# EAGLE design pdu (EAGLE 9.6.2)
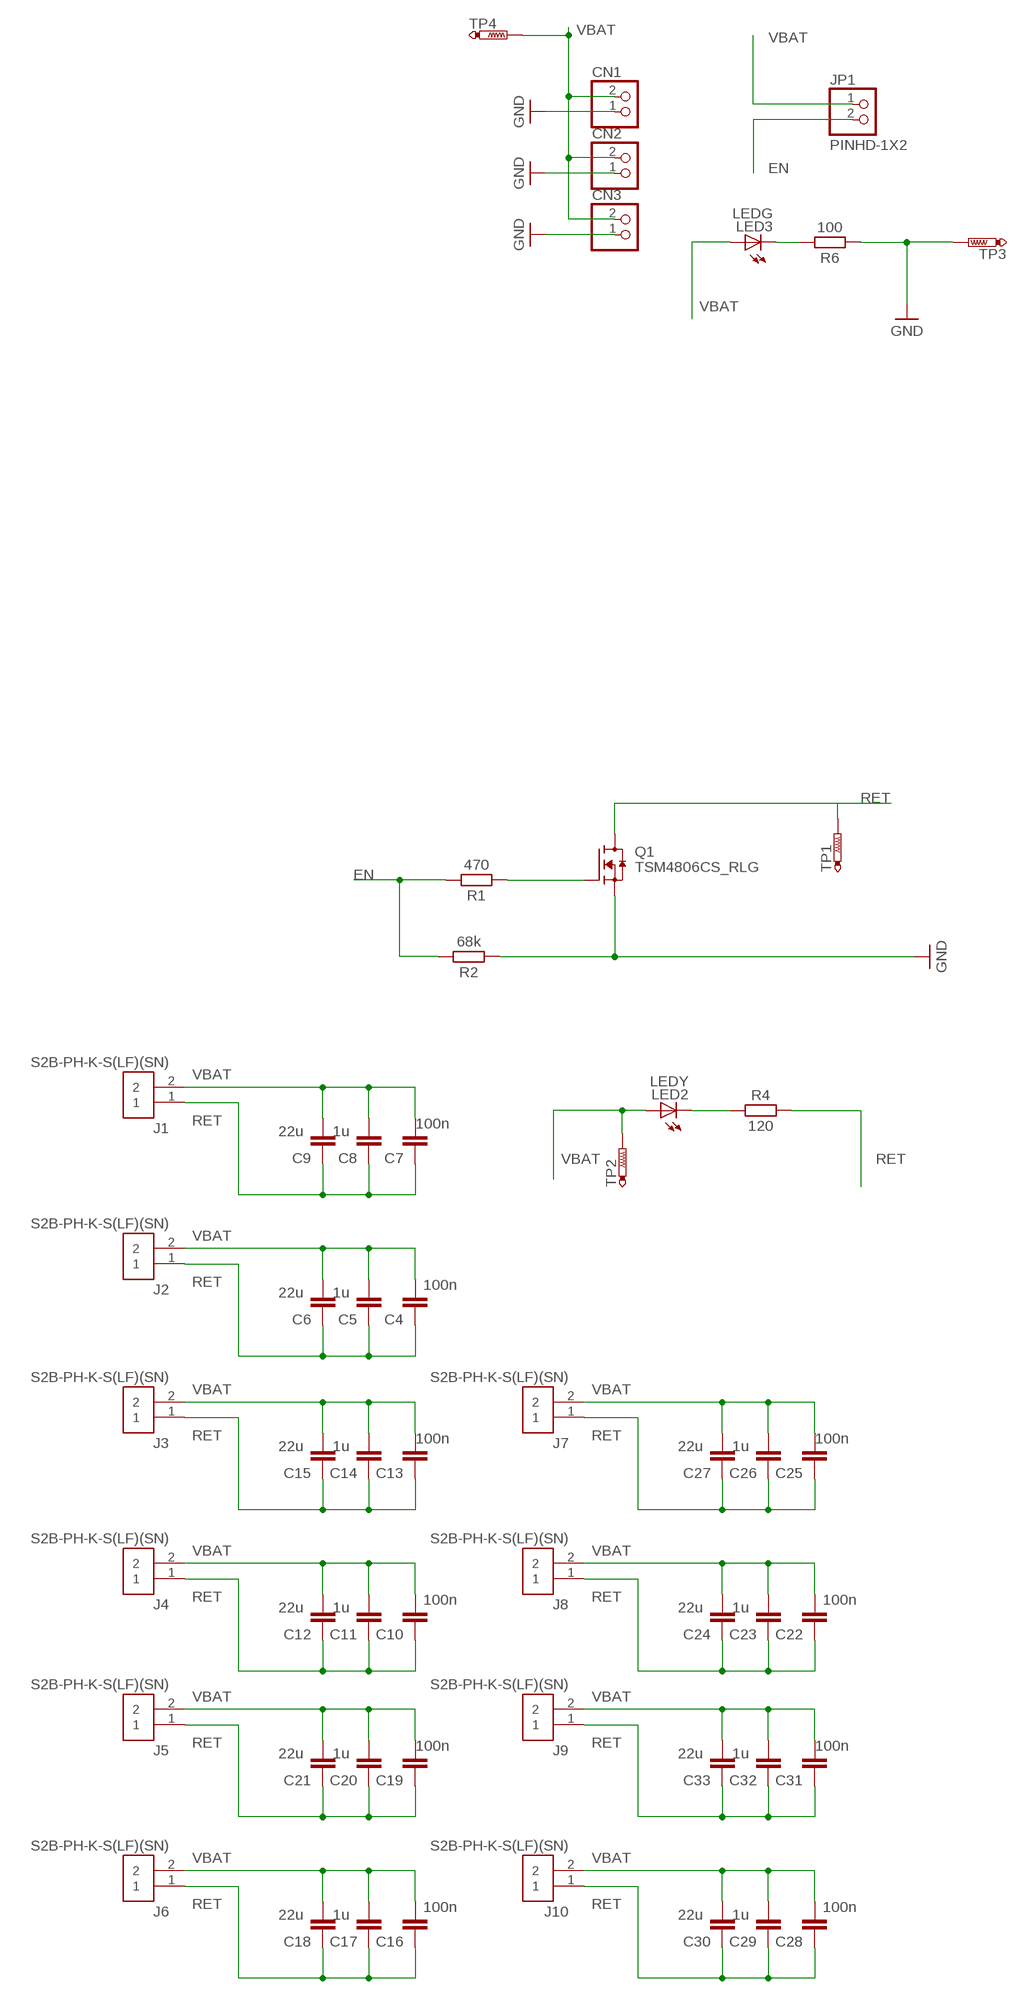
[diagram p0: schematic, sheet 1]

## Parts
C4  100n  C_CHIP-0603(1608-METRIC)  [CAPC1608X85]
C5  1u  C_CHIP-0603(1608-METRIC)  [CAPC1608X85]
C6  22u  C_CHIP-0603(1608-METRIC)  [CAPC1608X85]
C7  100n  C_CHIP-0603(1608-METRIC)  [CAPC1608X85]
C8  1u  C_CHIP-0603(1608-METRIC)  [CAPC1608X85]
C9  22u  C_CHIP-0603(1608-METRIC)  [CAPC1608X85]
C10  100n  C_CHIP-0603(1608-METRIC)  [CAPC1608X85]
C11  1u  C_CHIP-0603(1608-METRIC)  [CAPC1608X85]
C12  22u  C_CHIP-0603(1608-METRIC)  [CAPC1608X85]
C13  100n  C_CHIP-0603(1608-METRIC)  [CAPC1608X85]
C14  1u  C_CHIP-0603(1608-METRIC)  [CAPC1608X85]
C15  22u  C_CHIP-0603(1608-METRIC)  [CAPC1608X85]
C16  100n  C_CHIP-0603(1608-METRIC)  [CAPC1608X85]
C17  1u  C_CHIP-0603(1608-METRIC)  [CAPC1608X85]
C18  22u  C_CHIP-0603(1608-METRIC)  [CAPC1608X85]
C19  100n  C_CHIP-0603(1608-METRIC)  [CAPC1608X85]
C20  1u  C_CHIP-0603(1608-METRIC)  [CAPC1608X85]
C21  22u  C_CHIP-0603(1608-METRIC)  [CAPC1608X85]
C22  100n  C_CHIP-0603(1608-METRIC)  [CAPC1608X85]
C23  1u  C_CHIP-0603(1608-METRIC)  [CAPC1608X85]
C24  22u  C_CHIP-0603(1608-METRIC)  [CAPC1608X85]
C25  100n  C_CHIP-0603(1608-METRIC)  [CAPC1608X85]
C26  1u  C_CHIP-0603(1608-METRIC)  [CAPC1608X85]
C27  22u  C_CHIP-0603(1608-METRIC)  [CAPC1608X85]
C28  100n  C_CHIP-0603(1608-METRIC)  [CAPC1608X85]
C29  1u  C_CHIP-0603(1608-METRIC)  [CAPC1608X85]
C30  22u  C_CHIP-0603(1608-METRIC)  [CAPC1608X85]
C31  100n  C_CHIP-0603(1608-METRIC)  [CAPC1608X85]
C32  1u  C_CHIP-0603(1608-METRIC)  [CAPC1608X85]
C33  22u  C_CHIP-0603(1608-METRIC)  [CAPC1608X85]
CN1  JST_2PIN-THM-RA  [JST-PH-2-THM-RA]
CN2  JST_2PIN-THM-RA  [JST-PH-2-THM-RA]
CN3  JST_2PIN-THM-RA  [JST-PH-2-THM-RA]
J1  S2B-PH-K-S(LF)(SN)  [S2B-PH-K-S(LF)(SN)]
J2  S2B-PH-K-S(LF)(SN)  [S2B-PH-K-S(LF)(SN)]
J3  S2B-PH-K-S(LF)(SN)  [S2B-PH-K-S(LF)(SN)]
J4  S2B-PH-K-S(LF)(SN)  [S2B-PH-K-S(LF)(SN)]
J5  S2B-PH-K-S(LF)(SN)  [S2B-PH-K-S(LF)(SN)]
J6  S2B-PH-K-S(LF)(SN)  [S2B-PH-K-S(LF)(SN)]
J7  S2B-PH-K-S(LF)(SN)  [S2B-PH-K-S(LF)(SN)]
J8  S2B-PH-K-S(LF)(SN)  [S2B-PH-K-S(LF)(SN)]
J9  S2B-PH-K-S(LF)(SN)  [S2B-PH-K-S(LF)(SN)]
J10  S2B-PH-K-S(LF)(SN)  [S2B-PH-K-S(LF)(SN)]
JP1  PINHD-1X2  [1X02]
LED2  LEDY  LEDCHIPLED_0805  [CHIPLED_0805]
LED3  LEDG  LEDCHIPLED_0805  [CHIPLED_0805]
Q1  TSM4806CS_RLG  [SOP127P600X200-8N]
R1  470  R_CHIP-0603(1608-METRIC)  [RESC1608X60]
R2  68k  R_CHIP-0603(1608-METRIC)  [RESC1608X60]
R4  120  R_CHIP-0603(1608-METRIC)  [RESC1608X60]
R6  100  R_CHIP-0603(1608-METRIC)  [RESC1608X60]
TP1  PTR1PAD1-13  [P1-13]
TP2  PTR1PAD1-13  [P1-13]
TP3  PTR1PAD1-13  [P1-13]
TP4  PTR1PAD1-13  [P1-13]

## Nets
EN: JP1.2 R1.2 R2.2
GND: CN1.1 CN2.1 CN3.1 Q1.1(S) Q1.2(S) Q1.3(S) R2.1 R6.1 TP3.TP
N$1: Q1.4(G) R1.1
N$4: LED3.C R6.2
N$5: LED2.C R4.1
RET: C4.1 C5.1 C6.1 C7.1 C8.1 C9.1 C10.1 C11.1 C12.1 C13.1 C14.1 C15.1 C16.1 C17.1 C18.1 C19.1 C20.1 C21.1 C22.1 C23.1 C24.1 C25.1 C26.1 C27.1 C28.1 C29.1 C30.1 C31.1 C32.1 C33.1 J1.1 J2.1 J3.1 J4.1 J5.1 J6.1 J7.1 J8.1 J9.1 J10.1 Q1.5(D) Q1.6(D) Q1.7(D) Q1.8(D) R4.2 TP1.TP
VBAT: C4.2 C5.2 C6.2 C7.2 C8.2 C9.2 C10.2 C11.2 C12.2 C13.2 C14.2 C15.2 C16.2 C17.2 C18.2 C19.2 C20.2 C21.2 C22.2 C23.2 C24.2 C25.2 C26.2 C27.2 C28.2 C29.2 C30.2 C31.2 C32.2 C33.2 CN1.2 CN2.2 CN3.2 J1.2 J2.2 J3.2 J4.2 J5.2 J6.2 J7.2 J8.2 J9.2 J10.2 JP1.1 LED2.A LED3.A TP2.TP TP4.TP

## Library data of the parts
C4-C33 = Capacitor:C: Capacitor - Generic; CATEGORY: Capacitor
CN1-CN3 = adafruit:JST_2PIN: JST 2-Pin Connectors of various flavors SMT-RA (S2B-PH-SM4) 4UConnector #17311 SMT (B2B-PH-SM4) THM-RA (S2B-PH) THM (B2B-PH)
J1-J10 = Connectors:S2B-PH-K-S(LF)(SN): CONN HEADER R/A 2POS 2MM Manufacturer's datasheet <http://www.jst-mfg.com/product/pdf/eng/ePH.pdf>; CREATED_BY: PCBLayout.com; DIGI_KEY_PART_NUMBER: 455-1719-ND; MANUFACTURER: JST Sales America Inc.; MPN: S2B-PH-K-S(LF)(SN)
JP1 = Connector:PINHD-1X2: PIN HEADER; CATEGORY: Headers; DESCRIPTION: Header, Straight, 2 Position; MANUFACTURER: Generic; MPN: Generic; OPERATING_TEMPERATURE: Generic; PART_STATUS: Active; PITCH: 0.100" (2.54mm); ROHS_COMPLIANCE: Generic; SERIES: Generic; SUB-CATEGORY: Headers, Male Pins; TYPE: Board to Board or Cable, Unshrouded, Through Hole, Straight
LED2 LED3 = adafruit:LED: LED OSRAM: - CHIPLED LG R971, LG N971, LY N971, LG Q971, LY Q971, LO R971, LY R971 LH N974, LH R974 LS Q976, LO Q976, LY Q976 LO Q996 - Hyper CHIPLED LW Q18S LB Q993, LB Q99A, LB R99A - SideLED LS A670, LO A670, LY A670, LG A670, LP A670 LB A673, LV A673, LT A673, LW A673 LH A674 LY A675 LS A676, LA A676, LO A676, LY A676, LW A676 LS A679, LY A679, LG A679 - Hyper Micro SIDELED® LS Y876, LA Y876, LO Y876, LY Y876 LT Y87S - SmartLED LW L88C, LW L88S LB L89C, LB L89S, LG L890 LS L89K, LO L89K, LY L89K LS L896, LA L896, LO L896, LY L896 - TOPLED LS T670, LO T670, LY T670, LG T670, LP T670 LSG T670, LSP T670, LSY T670, LOP T670, LYG T670 LG T671, LOG T671, LSG T671 LB T673, LV T673, LT T673, LW T673 LH T674 LS T676, LA T676, LO T676, LY T676, LB T676, LH T676, LSB T676, LW T676 LB T67C, LV T67C, LT T67C, LS T67K, LO T67K, LY T67K, LW E67C LS E67B, LA E67B, LO E67B, LY E67B, LB E67C, LV E67C, LT E67C LW T67C LS T679, LY T679, LG T679 LS T770, LO T770, LY T770, LG T770, LP T770 LB T773, LV T773, LT T773, LW T773 LH T774 LS E675, LA E675, LY E675, LS T675 LS T776, LA T776, LO T776, LY T776, LB T776 LHGB T686 LT T68C, LB T68C - Hyper Mini TOPLED® LB M676 - Mini TOPLED Santana® LG M470 LS M47K, LO M47K, LY M47K Source: http://www.osram.convergy.de/
Q1 = TSM4806CS_RLG:TSM4806CS_RLG; MANUFACTURER: Taiwan Semiconductor; MAXIMUM_PACKAGE_HEIGHT: 2.00mm; PARTREV: A14; STANDARD: IPC-7351B
R1 R2 R4 R6 = Resistor:R: Resistor Fixed - Generic; CATEGORY: Resistor; SUB-CATEGORY: Fixed
TP1-TP4 = testpad:PTR1: TEST PIN

## Board
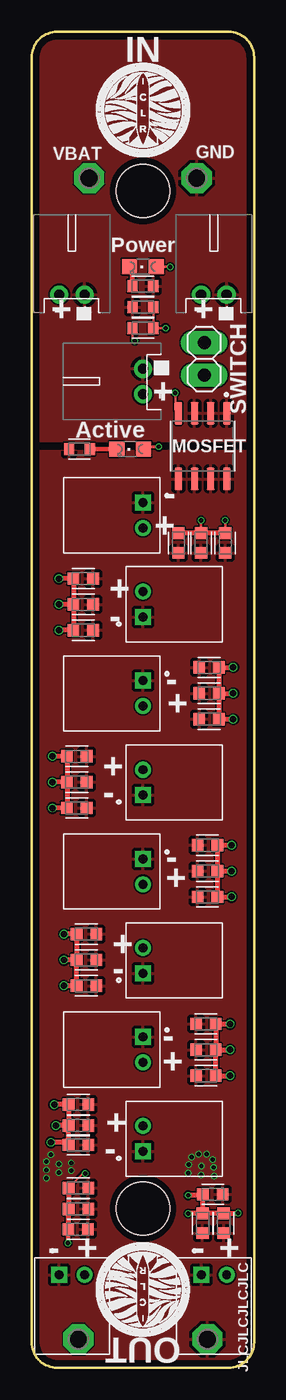
[diagram p1: board, top side]
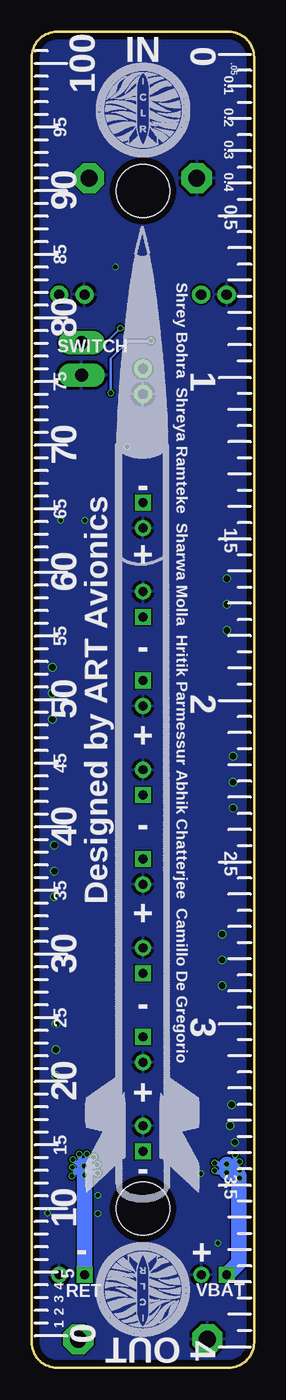
[diagram p2: board, bottom side, seen from below]

Size 17.5 x 105 mm. Coordinates in mm from the lower left corner, seen from the top.
Outline: 15.5,0 2,0 arc-90 0,2 0,103 arc-90 2,105 15.5,105 arc-90 17.5,103 17.5,2 arc-90 15.5,0
Copper layers (1*16): Top 0.035mm / dielectric 1.6mm / Bottom 0.035mm
Design rules "jlcpcb-2layers *": minimum track width 5mil, minimum drill 0.3mm, track to track 5mil, track to pad 5mil, pad to pad 5mil, via to via 5mil, smd to smd 5mil, copper to edge 0.5mm, drill to drill 6mil, minimum pad ring 10mil, minimum via ring 3mil, stop-mask expansion 4mil, vias tented up to drill 1mm, thermal gap 10mil
Holes 4.2 mm at 8.75,92.5 8.75,12.5

### Footprints (pad centres in the part's own frame; a part is rotated, then mirrored left to right if it is on the bottom)
CAPC1608X85 = smd 0.921 x 0.97: 1 -0.775,0; 2 0.775,0
JST-PH-2-THM-RA = drill 0.8 pad 1.422: 1 1,0; 2 -1,0
S2B-PH-K-S(LF)(SN) = drill 0.7 square: 1 -1,0 | drill 0.7: 2 1,0
1X02 = drill 1.016 long: 1 -1.27,0; 2 1.27,0
CHIPLED_0805 = smd 1.2 x 1.2: A 0,-1.05; C 0,1.05
SOP127P600X200-8N = smd 1.76 x 0.6: 1 -2.58,1.905; 2 -2.58,0.635; 3 -2.58,-0.635; 4 -2.58,-1.905; 5 2.58,-1.905; 6 2.58,-0.635; 7 2.58,0.635; 8 2.58,1.905
RESC1608X60 = smd 0.799 x 0.974: 1 -0.815,0; 2 0.815,0
P1-13 = drill 1.321 pad 2.159 octagon: TP 0,0

### Placement (x,y rotation side)
C4  14.25,13.63 180 top
C5  3.65,10.88 180 top
C6  3.67,14.12 180 top
C7  3.67,12.47 180 top
C8  13.45,11.35 90 top
C9  15.1,11.35 90 top
C10  3.67,20.69 180 top
C11  4.3,30.02 180 top
C12  3.67,19.04 180 top
C13  4.3,34.09 180 top
C14  3.67,17.51 180 top
C15  4.3,32.05 180 top
C16  3.54,48.05 180 top
C17  3.54,43.99 180 top
C18  3.54,46.02 180 top
C19  4.05,62.02 180 top
C20  4.05,57.96 180 top
C21  4.05,59.99 180 top
C22  13.83,41.07 0 top
C23  13.7,22.96 0 top
C24  13.7,24.99 0 top
C25  13.7,27.02 0 top
C26  11.54,64.82 90 top
C27  13.83,39.04 0 top
C28  13.96,55.04 0 top
C29  13.96,50.98 0 top
C30  13.96,53.01 0 top
C31  15.23,64.82 90 top
C32  13.83,37.01 0 top
C33  13.32,64.82 90 top
CN1  8.75,77.52 90 top
CN2  14.34,84.34 0 top
CN3  3.16,84.34 0 top
J1  14.34,7.29 0 top
J2  3.16,7.29 0 top
J3  8.75,67 270 top
J4  8.75,60 90 top
J5  8.75,53 270 top
J6  8.75,46 90 top
J7  8.75,39 270 top
J8  8.75,32 90 top
J9  8.75,25 270 top
J10  8.75,18 90 top
JP1  13.58,79.3 90 top
LED2  7.75,72.2 90 top
LED3  8.75,86.54 90 top
Q1  13.45,72.44 270 top
R1  8.75,81.71 0 top
R2  8.75,83.36 0 top
R4  3.75,72.2 180 top
R6  8.75,85.01 180 top
TP1  13.83,2.24 0 top
TP2  3.67,2.24 0 top
TP3  12.98,93.5 0 top
TP4  4.52,93.5 0 top

### Tracks (layer width: path | path; a pad name or v marks a point on that pad's centre or on a via)
EN  (via drill 0.35)
  Top 0.178: v10.53,81.71 R1.2 R2.2
  Bottom 0.178: JP1.2 11.67,80.57 v10.53,81.71
GND
  pour Top: -2.68,107.49 20.18,107.49 20.18,72.82 -2.68,72.82
N$1  (via drill 0.35)
  Top 0.178: Q1.4 11.29,75.27 v11.29,76.63 | v8.12,80.69 7.94,80.87 R1.1
  Bottom 0.178: v8.12,80.69 9.89,80.69 11.29,79.3 v11.29,76.63
N$4
  Top 0.4: R6.2 7.94,86.3 LED3.C
N$5
  Top 0.35: LED2.C R4.1
RET  (via drill 0.35)
  Bottom 0.35: 1.85,15.5 1.2,15.5 v1.15,15.55 | v3.1,15.5 2.95,15.35 v2.15,15.35 | v2.15,15.35 2.9,16.1 v3.1,16.1 | v2.15,15.35 2,15.35 1.85,15.5 | 1.85,15.5 v1.15,16.2 | v2.15,15.35 1.5,16 v1.5,16.75 | v2.15,15.35 1.7,14.9 v1.15,14.9 | 13.34,15.5 13.75,15.5 | 13.75,15.5 14.05,15.5 v14.3,15.75 | 13.75,15.5 13.75,15.85 | v14.25,16.35 13.75,15.85 | 13.75,15.85 v13.75,16.8 | 13.75,15.85 13.15,16.45 v13.15,16.8 | 13.31,15.84 13.34,15.84 12.8,15.3 v12.3,15.3 | 13.31,15.84 v12.6,16.55 | 13.31,15.84 12.46,15.84 v12.35,15.95 | v13.35,15.85 13.55,15.85 v14.35,15.05
  Bottom 1.2: J2.1 1.2,8.25 1.2,15.1 1.45,15.35 v2.15,15.35 v2.15,16 | J1.1 v13.34,15.15 13.34,15.5 13.34,15.84 v13.35,15.85
  pour Top: -2.68,72.06 20.18,72.06 20.18,-2.76 -2.68,-2.76
VBAT  (via drill 0.35, 0.51)
  Top 0.178: 13.2,65.72 C33.2 v13.32,66.6 | C31.2 v15.23,66.6 | LED3.A v10.91,86.54
  Top 0.2: C6.2 4.02,15.25 v4.2,15.25
  Top 0.254: LED2.A 9,72.4 v10,72.4
  Top 0.35: C5.2 2.87,9.82 v2.85,9.8
  Top 0.381: C21.2 C19.2 v2.15,62.02 | C21.2 C20.2 v2.15,57.96 | C18.2 C16.2 v1.64,48.05 | C18.2 C17.2 v1.64,43.99 | C30.2 C28.2 v15.86,55.04 | C30.2 C29.2 v15.86,50.98 | C27.2 C22.2 v15.73,41.07 | C27.2 C32.2 v15.73,37.01 | C15.2 C13.2 v2.53,34.09 | C15.2 C11.2 v2.53,30.02 | C24.2 C23.2 v15.61,22.96 | C24.2 C25.2 v15.61,27.02 | C14.2 C12.2 | C12.2 C10.2 v1.76,20.69 | C8.2 C9.2 15.12,12.15 v16.25,12.15 | C24.2 v15.61,24.99 | C14.2 2.7,17.71 v1.51,17.71 | C12.2 v1.89,19.04 | C15.2 v2.53,32.05 | C27.2 v15.73,39.04 | C18.2 v1.64,46.02 | C30.2 v15.86,53.01 | C21.2 v2.15,59.99 | C14.2 | C6.2 C7.2 2.87,12.45 C5.2 | C8.2 13.47,12.15 C4.2 13.39,13.55 v12.3,13.55 | C8.2 12.33,12.13 v12.3,12.1
  Top 0.4: C26.2 C33.2 C31.2
  pour Bottom: -1.41,106.22 18.91,106.22 18.91,-1.49 -1.41,-1.49

### Text on the board
tPlace: IN | GND | VBAT | Power | + | + | SWITCH | + | Active | MOSFET | - | + | + | - | - | + | + | - | - | + | + | - | - | + | + | - | - | + | - | + | JLCJLCJLCJLC | OUT
bPlace: 100 | 0 | .05 | IN | 0.1 | 0.2 | 95 | 0.3 | 0.4 | 0.5 | 90 | 85 | Shrey Bohra Shreya Ramteke Sharwa Molla Hritik Parmessur Abhik Chatterjee Camillo De Gregorio | 80 | SWITCH | 1 | 75 | 70 | - | 65 | 1.5 | + | 60 | 55 | - | 2 | Designed by ART Avionics | 50 | + | 45 | - | 2.5 | 40 | 35 | + | 30 | - | 25 | 3 | + | 20 | 15 | 3.5 | - | 10 | + | - | 5 | 4 | VBAT | RET | 3 | 2 | 1 | 4 | OUT | 0